# Altium project PCB_Project1.PrjPCB
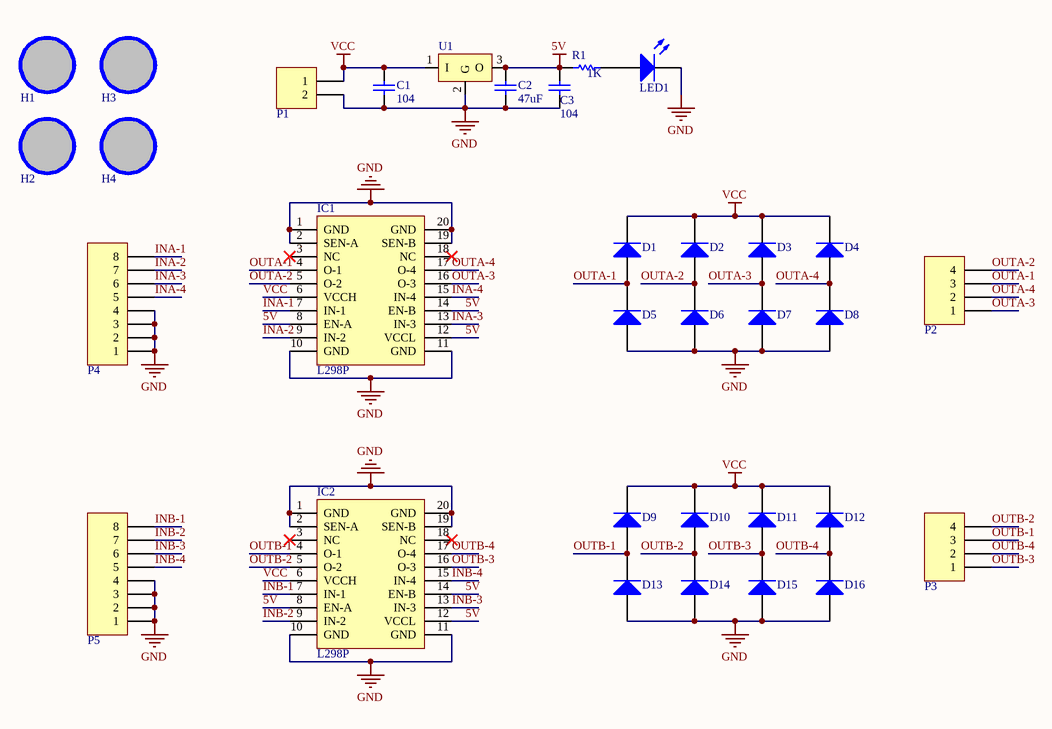
[diagram p0: Driver.SchDoc]
1 sheet, 33 parts. Net scope: global (net labels, ports and power ports of the same name join across sheets).
Board file: Driver.PcbDoc

## Sheet Driver.SchDoc
size A

### Parts
C1  value 104  [CAP-SM-0805]  (hidden comment: Cap Non-Pol SMD)
C2  value 47uF  [CAP-2312]  (hidden comment: Cap Non-Pol SMD)
C3  value 104  [CAP-SM-0805]  (hidden comment: Cap Non-Pol SMD)
D1  Diode-S  [SS34]  (value not drawn)
D2  Diode-S  [SS34]  (value not drawn)
D3  Diode-S  [SS34]  (value not drawn)
D4  Diode-S  [SS34]  (value not drawn)
D5  Diode-S  [SS34]  (value not drawn)
D6  Diode-S  [SS34]  (value not drawn)
D7  Diode-S  [SS34]  (value not drawn)
D8  Diode-S  [SS34]  (value not drawn)
D9  Diode-S  [SS34]  (value not drawn)
D10  Diode-S  [SS34]  (value not drawn)
D11  Diode-S  [SS34]  (value not drawn)
D12  Diode-S  [SS34]  (value not drawn)
D13  Diode-S  [SS34]  (value not drawn)
D14  Diode-S  [SS34]  (value not drawn)
D15  Diode-S  [SS34]  (value not drawn)
D16  Diode-S  [SS34]  (value not drawn)
H1  Hole  [LO KHOAN 3MM]  (value not drawn)
H2  Hole  [LO KHOAN 3MM]  (value not drawn)
H3  Hole  [LO KHOAN 3MM]  (value not drawn)
H4  Hole  [LO KHOAN 3MM]  (value not drawn)
IC1  L298P  [L298P]
IC2  L298P  [L298P]
LED1  LED SMD  [LED_0805_Blue]  (value not drawn)
P1  Domino 2  [DOMINO 2- 5mm]  (value not drawn)
P2  Domino 4  [DOMINO 4 -5mm]  (value not drawn)
P3  Domino 4  [DOMINO 4 -5mm]  (value not drawn)
P4  Header 8  [JP8]  (value not drawn)
P5  Header 8  [JP8]  (value not drawn)
R1  value 1K  [RES-SM-0805]  (hidden comment: RESISTOR SMD)
U1  LM78xx  [TO252-123]  (value not drawn)

### Nets
5V: C2.2 C3.2 IC1.8(EN-A) IC1.12(VCCL) IC1.14(EN-B) IC2.8(EN-A) IC2.12(VCCL) IC2.14(EN-B) R1.1 U1.3(O)
GND: C1.1 C2.1 C3.1 D5.2(K) D6.2(K) D7.2(K) D8.2(K) D13.2(K) D14.2(K) D15.2(K) D16.2(K) IC1.1(GND) IC1.2(SEN-A) IC1.10(GND) IC1.11(GND) IC1.19(SEN-B) IC1.20(GND) IC2.1(GND) IC2.2(SEN-A) IC2.10(GND) IC2.11(GND) IC2.19(SEN-B) IC2.20(GND) LED1.2(K) P1.2 P4.1 P4.2 P4.3 P4.4 P5.1 P5.2 P5.3 P5.4 U1.2(G)
VCC: C1.2 D1.1(A) D2.1(A) D3.1(A) D4.1(A) D9.1(A) D10.1(A) D11.1(A) D12.1(A) IC1.6(VCCH) IC2.6(VCCH) P1.1 U1.1(I)
INA-1: IC1.7(IN-1) P4.8
INA-2: IC1.9(IN-2) P4.7
INA-3: IC1.13(IN-3) P4.6
INA-4: IC1.15(IN-4) P4.5
INB-1: IC2.7(IN-1) P5.8
INB-2: IC2.9(IN-2) P5.7
INB-3: IC2.13(IN-3) P5.6
INB-4: IC2.15(IN-4) P5.5
OUTA-1: D1.2(K) D5.1(A) IC1.4(O-1) P2.3
OUTA-2: D2.2(K) D6.1(A) IC1.5(O-2) P2.4
OUTA-3: D3.2(K) D7.1(A) IC1.16(O-3) P2.1
OUTA-4: D4.2(K) D8.1(A) IC1.17(O-4) P2.2
OUTB-1: D9.2(K) D13.1(A) IC2.4(O-1) P3.3
OUTB-2: D10.2(K) D14.1(A) IC2.5(O-2) P3.4
OUTB-3: D11.2(K) D15.1(A) IC2.16(O-3) P3.1
OUTB-4: D12.2(K) D16.1(A) IC2.17(O-4) P3.2
NetLED1_1: LED1.1(A) R1.2

Not connected (* = marked no-connect by the designer): H1 1; H2 1; H3 1; H4 1; IC1 3(NC)* 18(NC)*; IC2 3(NC)* 18(NC)*

### Library data of the parts
C1-C3 = Cap Non-Pol SMD: Capacitor
H1-H4 = Hole: Hole 3mm
LED1 = LED SMD: LED
P1 = Domino 2: Domino, 2-Pin; LatestRevisionDate: 17-Jul-2002; LatestRevisionNote: Re-released for DXP Platform.; Publisher: Altium Limited
P2 P3 = Domino 4: Domino 4-Pin; LatestRevisionDate: 17-Jul-2002; LatestRevisionNote: Re-released for DXP Platform.; Publisher: Altium Limited
P4 P5 = Header 8: Header, 8-Pin; LatestRevisionDate: 17-Jul-2002; LatestRevisionNote: Re-released for DXP Platform.; Publisher: Altium Limited
R1 = RESISTOR SMD: Resistor
U1 = LM78xx: Positive Voltage Regulator; Note: Tab is connected to pin 3 (GND).; Published: 24-Aug-2001; LatestRevisionDate: 17-Jul-2002; LatestRevisionNote: Re-released for DXP Platform.; DatasheetVersion: Apr-1994; PackageVersion: Jul-1998; PackageReference: ISOWATT220AB; Publisher: Altium Limited; PackageDescription: TO, Thru-Hole, Vertical, Heatsink Mounted; 3 In-Line Leads; Pitch 2.54 mm; Pin sequence 1, 3, 2; ComponentLink1Description: Manufacturer Link; ComponentLink1URL: http://www.st.com/; ComponentLink2Description: Datasheet; ComponentLink2URL: http://www.st.com/stonline/products/literature/ds/2146/l78m05c.pdf